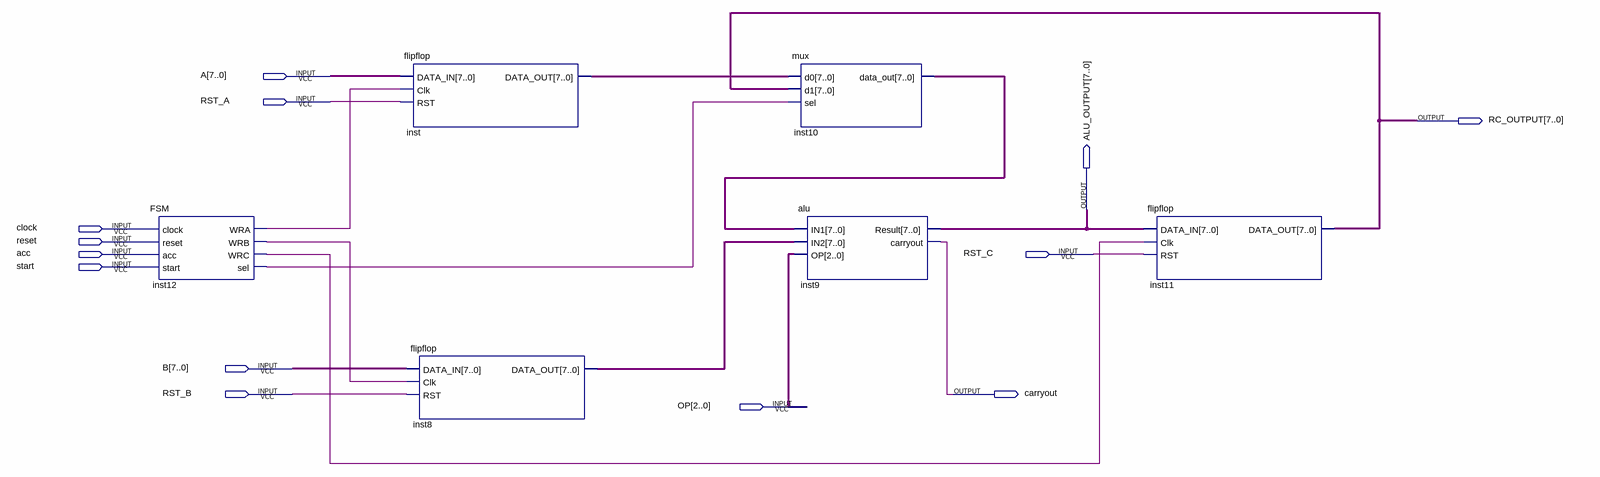
[diagram p0: schematic sheet]
// Quartus schematic alu-controller.bdf as structural Verilog: 6 symbols, 13 pins
module \alu-controller  (
  input  [7:0] A,
  input  RST_A,
  input  clock,
  input  reset,
  input  acc,
  input  RST_C,
  input  start,
  input  [7:0] B,
  input  RST_B,
  input  [2:0] OP,
  output [7:0] RC_OUTPUT,
  output [7:0] ALU_OUTPUT,
  output carryout
);

  wire inst12_sel, inst12_wra, inst12_wrb, inst12_wrc;
  wire [7:0] inst8_data_out, inst10_data_out, inst_data_out;

  FSM inst12 (
    .clock(clock), .reset(reset), .acc(acc), .start(start), .WRA(inst12_wra), .WRB(inst12_wrb),
    .WRC(inst12_wrc), .sel(inst12_sel));
  flipflop inst (.DATA_IN(A), .Clk(inst12_wra), .RST(RST_A), .DATA_OUT(inst_data_out));
  flipflop inst8 (.DATA_IN(B), .Clk(inst12_wrb), .RST(RST_B), .DATA_OUT(inst8_data_out));
  mux inst10 (.d0(inst_data_out), .d1(RC_OUTPUT), .sel(inst12_sel), .data_out(inst10_data_out));
  alu inst9 (.IN1(inst10_data_out), .IN2(inst8_data_out), .OP(OP), .Result(ALU_OUTPUT), .carryout(carryout));
  flipflop inst11 (.DATA_IN(ALU_OUTPUT), .Clk(inst12_wrc), .RST(RST_C), .DATA_OUT(RC_OUTPUT));
endmodule
